# EAGLE design usbprog_v3_x1 (EAGLE 4.16)
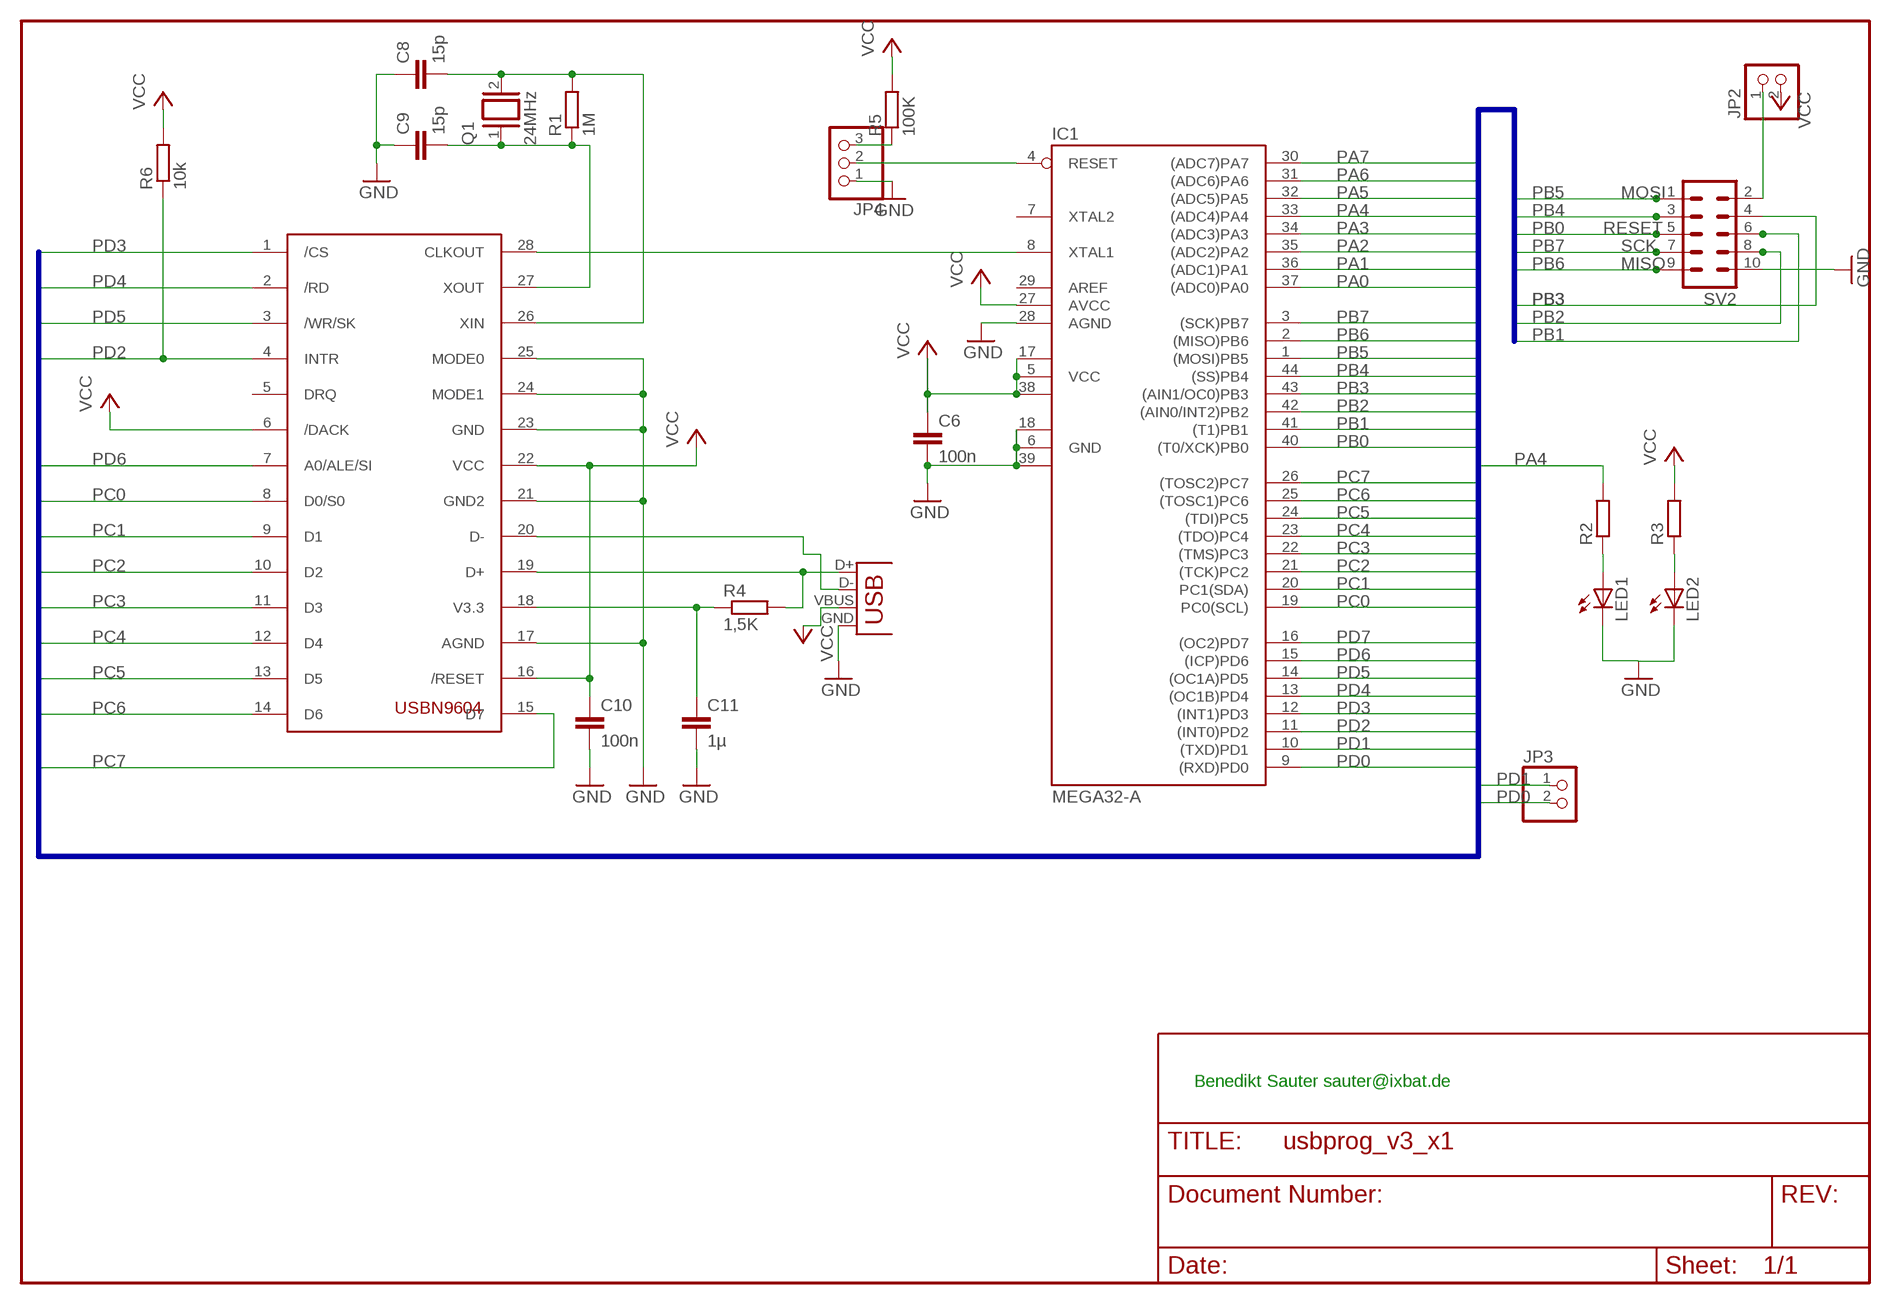
[diagram p0: schematic, sheet 1]

## Parts
C6  100n  C-EUC1206  [C1206]
C8  15p  C-EUC1206  [C1206]
C9  15p  C-EUC1206  [C1206]
C10  100n  C-EUC1206  [C1206]
C11  1µ  C-EUC1206  [C1206]
IC1  MEGA32-A  [TQFP44]
JP2  PINHD-1X2  [1X02]
JP3  PINHD-1X2  [1X02]
JP4  PINHD-1X3  [1X03]
LED1  LEDCHIP-LED0805  [CHIP-LED0805]
LED2  LEDCHIP-LED0805  [CHIP-LED0805]
M1  USBN9604  [SO28-3]
Q1  24MHz  XTAL/S  [QS]
R1  1M  R-EU_R1206  [R1206]
R2  R-EU_M1206  [M1206]
R3  R-EU_M1206  [M1206]
R4  1,5K  R-EU_M1206  [M1206]
R5  100K  R-EU_R1206  [R1206]
R6  10k  R-EU_R1206  [R1206]
SV2  ML10L  [ML10L]
X2  USB-B-H  [USB-B-H]

## Nets
GND: C6.2 C8.1 C9.1 C10.2 C11.2 IC1.6(GND) IC1.18(GND1) IC1.28(AGND) IC1.39(GND2) JP4.1 LED1.C LED2.C M1.17(AGND) M1.21(GND2) M1.23(GND) M1.24(MODE1) M1.25(MODE0) SV2.10 X2.GND
N$3: JP3.1
N$4: IC1.8(XTAL1) M1.28(CLKOUT)
N$5: JP4.3 R5.1
N$7: C11.1 M1.18(V3.3) R4.1
N$8: C8.2 M1.26(XIN) Q1.2 R1.2
N$9: LED1.A R2.1
N$10: LED2.A R3.1
N$11: C9.2 M1.27(XOUT) Q1.1 R1.1
N$12: M1.19(D+) R4.2 X2.D+
N$13: JP3.2
N$14: JP2.1 SV2.2
N$15: M1.20(D-) X2.D-
PA0: IC1.37((ADC0)PA0)
PA1: IC1.36((ADC1)PA1)
PA2: IC1.35((ADC2)PA2)
PA3: IC1.34((ADC3)PA3)
PA4: IC1.33((ADC4)PA4) R2.2
PA5: IC1.32((ADC5)PA5)
PA6: IC1.31((ADC6)PA6)
PA7: IC1.30((ADC7)PA7)
PB0: IC1.40((T0/XCK)PB0) SV2.5
PB1: IC1.41((T1)PB1) SV2.6
PB2: IC1.42((AIN0/INT2)PB2) SV2.8
PB3: IC1.43((AIN1/OC0)PB3) SV2.4
PB4: IC1.44((SS)PB4) SV2.3
PB5: IC1.1((MOSI)PB5) SV2.1
PB6: IC1.2((MISO)PB6) SV2.9
PB7: IC1.3((SCK)PB7) SV2.7
PC0: IC1.19(PC0(SCL)) M1.8(D0/S0)
PC1: IC1.20(PC1(SDA)) M1.9(D1)
PC2: IC1.21((TCK)PC2) M1.10(D2)
PC3: IC1.22((TMS)PC3) M1.11(D3)
PC4: IC1.23((TDO)PC4) M1.12(D4)
PC5: IC1.24((TDI)PC5) M1.13(D5)
PC6: IC1.25((TOSC1)PC6) M1.14(D6)
PC7: IC1.26((TOSC2)PC7) M1.15(D7)
PD0: IC1.9((RXD)PD0)
PD1: IC1.10((TXD)PD1)
PD2: IC1.11((INT0)PD2) M1.4(INTR) R6.1
PD3: IC1.12((INT1)PD3) M1.1(/CS)
PD4: IC1.13((OC1B)PD4) M1.2(/RD)
PD5: IC1.14((OC1A)PD5) M1.3(/WR/SK)
PD6: IC1.15((ICP)PD6) M1.7(A0/ALE/SI)
PD7: IC1.16((OC2)PD7)
RESET: IC1.4(RESET) JP4.2
VCC: C6.1 C10.1 IC1.5(VCC) IC1.17(VCC1) IC1.27(AVCC) IC1.38(VCC2) JP2.2 M1.6(/DACK) M1.16(/RESET) M1.22(VCC) R3.2 R5.2 R6.2 X2.VBUS
Unconnected: IC1.7(XTAL2) M1.5(DRQ)

## Buses
PD0,PD1,PD2,PD3,PD4,PD5,PD6,PD7,PC0,PC1,PC2,PC3,PC4,PC5,PC6,PC7,PB0,PB1,PB2,PB3,PB4,PB5,PB6,PB7,PA0,PA1,PA2,PA3,PA4,PA5,PA6,PA7

## Notes on the sheet
- MOSI
- PB4
- RESET
- SCK
- MISO
- PB3 | PB3
- PB2
- PB1
- Benedikt Sauter sauter@ixbat.de

## Power pins joined to a net without a drawn wire
AREF: IC1.29(AREF)

## Library data of the parts
C6 C8-C11 = rcl:C-EU: CAPACITOR, European symbol
IC1 = avr:MEGA32: MICROCONTROLLER 32 Kbytes FLASH 2 Kbytes SRAM 1 Kbytes EEPROM USART 8-channel 10 bit ADC
JP2 JP3 = pinhead:PINHD-1X2: PIN HEADER
JP4 = pinhead:PINHD-1X3: PIN HEADER
LED1 LED2 = led:LED: LED OSRAM: - CHIPLED LG R971, LG N971, LY N971, LG Q971, LY Q971, LO R971, LY R971 LH N974, LH R974 LS Q976, LO Q976, LY Q976 LO Q996 - Hyper CHIPLED LW Q18S LB Q993, LB Q99A, LB R99A - SideLED LS A670, LO A670, LY A670, LG A670, LP A670 LB A673, LV A673, LT A673, LW A673 LH A674 LY A675 LS A676, LA A676, LO A676, LY A676, LW A676 LS A679, LY A679, LG A679 - Hyper Micro SIDELED® LS Y876, LA Y876, LO Y876, LY Y876 LT Y87S - SmartLED LW L88C, LW L88S LB L89C, LB L89S, LG L890 LS L89K, LO L89K, LY L89K LS L896, LA L896, LO L896, LY L896 - TOPLED LS T670, LO T670, LY T670, LG T670, LP T670 LSG T670, LSP T670, LSY T670, LOP T670, LYG T670 LG T671, LOG T671, LSG T671 LB T673, LV T673, LT T673, LW T673 LH T674 LS T676, LA T676, LO T676, LY T676, LB T676, LH T676, LSB T676, LW T676 LB T67C, LV T67C, LT T67C, LS T67K, LO T67K, LY T67K, LW E67C LS E67B, LA E67B, LO E67B, LY E67B, LB E67C, LV E67C, LT E67C LW T67C LS T679, LY T679, LG T679 LS T770, LO T770, LY T770, LG T770, LP T770 LB T773, LV T773, LT T773, LW T773 LH T774 LS E675, LA E675, LY E675, LS T675 LS T776, LA T776, LO T776, LY T776, LB T776 LHGB T686 LT T68C, LB T68C - Hyper Mini TOPLED® LB M676 - Mini TOPLED Santana® LG M470 LS M47K, LO M47K, LY M47K Source: http://www.osram.convergy.de/
M1 = bene:USBN9604
Q1 = special:XTAL/S: CRYSTAL
R1-R6 = rcl:R-EU_: RESISTOR, European symbol
SV2 = con-harting-ml:ML10: HARTING
X2 = con-usb:USB: USB Connectors

## Board
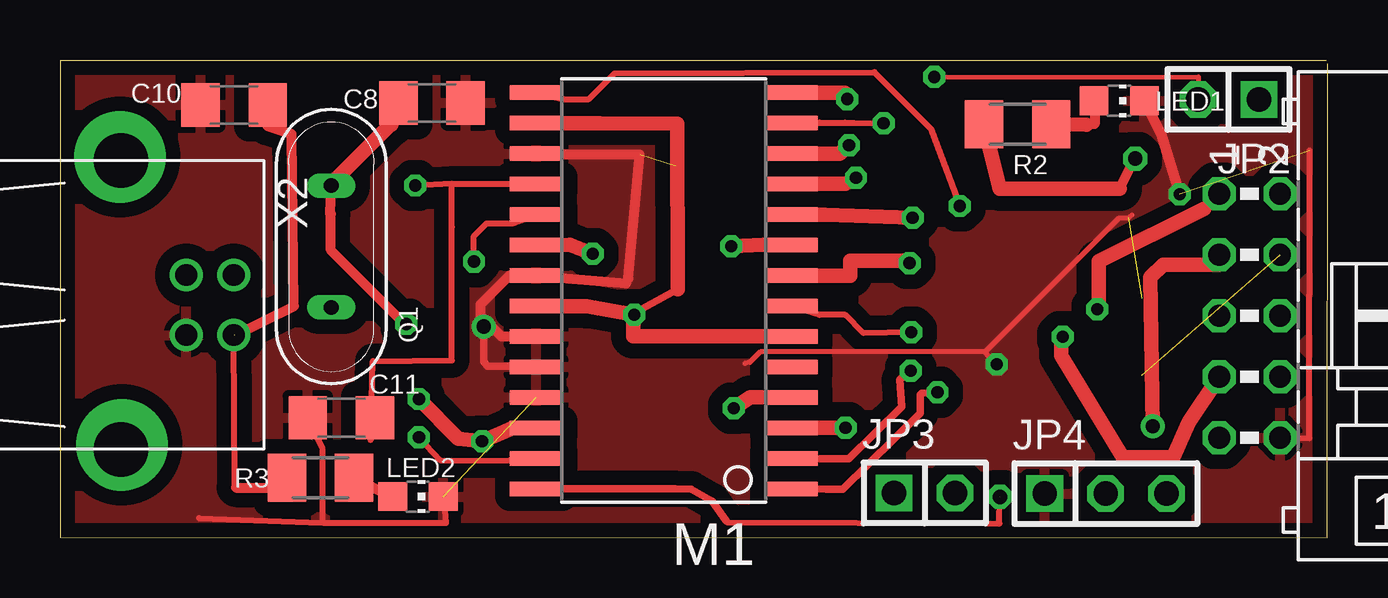
[diagram p1: board, top side]
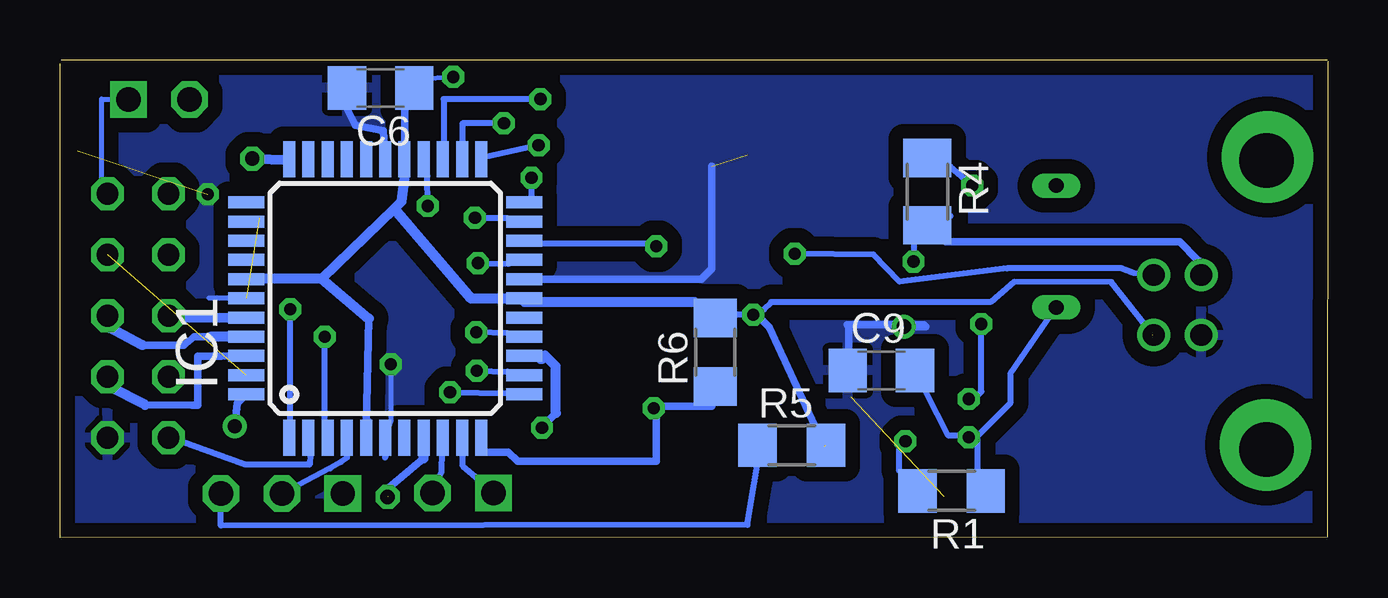
[diagram p2: board, bottom side, seen from below]

Size 52.81 x 19.9 mm. Coordinates in mm from the lower left corner, seen from the top.
Outline: 52.81,19.74 52.81,0 0.01,0.01 0,19.84
Outline: 0.01,19.9 52.76,19.9
Copper layers (1*16): Top 0.035mm / dielectric 1.5mm / Bottom 0.035mm
Design rules "ZWILLING": minimum track width 8mil, minimum drill 20mil, track to track 8mil, track to pad 8mil, pad to pad 8mil, via to via 8mil, smd to smd 0mil, copper to edge 10mil, drill to drill 10mil, minimum pad ring 8mil, minimum via ring 8mil, stop-mask expansion 4mil, vias tented up to drill 0mil, thermal gap 10mil

### Footprints (pad centres in the part's own frame; a part is rotated, then mirrored left to right if it is on the bottom)
C1206 = smd 1.6 x 1.8: 1 -1.4,0; 2 1.4,0
TQFP44 = smd 1.5 x 0.5: 1 -5.8,4; 2 -5.8,3.2; 3 -5.8,2.4; 4 -5.8,1.6; 5 -5.8,0.8; 6 -5.8,0; 7 -5.8,-0.8; 8 -5.8,-1.6; 9 -5.8,-2.4; 10 -5.8,-3.2; 11 -5.8,-4; 23 5.8,-4; 24 5.8,-3.2; 25 5.8,-2.4; 26 5.8,-1.6; 27 5.8,-0.8; 28 5.8,0; 29 5.8,0.8; 30 5.8,1.6; 31 5.8,2.4; 32 5.8,3.2; 33 5.8,4 | smd 0.5 x 1.5: 12 -4,-5.8; 13 -3.2,-5.8; 14 -2.4,-5.8; 15 -1.6,-5.8; 16 -0.8,-5.8; 17 0,-5.8; 18 0.8,-5.8; 19 1.6,-5.8; 20 2.4,-5.8; 21 3.2,-5.8; 22 4,-5.8; 34 4,5.8; 35 3.2,5.8; 36 2.4,5.8; 37 1.6,5.8; 38 0.8,5.8; 39 0,5.8; 40 -0.8,5.8; 41 -1.6,5.8; 42 -2.4,5.8; 43 -3.2,5.8; 44 -4,5.8
1X02 = drill 1.016 square: 1 -1.27,0 | drill 1.016 octagon: 2 1.27,0
1X03 = drill 1.016 square: 1 -2.54,0 | drill 1.016 octagon: 2 0,0; 3 2.54,0
CHIP-LED0805 = smd 1.2 x 1.2: A 0,-1.05; C 0,1.05
SO28-3 = smd 0.61 x 2.21: 1 -8.255,-5.315; 2 -6.985,-5.315; 3 -5.715,-5.315; 4 -4.445,-5.315; 5 -3.175,-5.315; 6 -1.905,-5.315; 7 -0.635,-5.315; 8 0.635,-5.315; 9 1.905,-5.315; 10 3.175,-5.315; 11 4.445,-5.315; 12 5.715,-5.315; 13 6.985,-5.315; 14 8.255,-5.315; 15 8.255,5.315; 16 6.985,5.315; 17 5.715,5.315; 18 4.445,5.315; 19 3.175,5.315; 20 1.905,5.315; 21 0.635,5.315; 22 -0.635,5.315; 23 -1.905,5.315; 24 -3.175,5.315; 25 -4.445,5.315; 26 -5.715,5.315; 27 -6.985,5.315; 28 -8.255,5.315
QS = drill 0.61 long: 1 -2.54,0; 2 2.54,0
R1206 = smd 1.6 x 1.803: 1 -1.422,0; 2 1.422,0
M1206 = smd 1.6 x 2: 1 -1.4,0; 2 1.4,0
ML10L = drill 0.914 octagon: 1 -5.08,-1.27; 2 -5.08,1.27; 3 -2.54,-1.27; 4 -2.54,1.27; 5 0,-1.27; 6 0,1.27; 7 2.54,-1.27; 8 2.54,1.27; 9 5.08,-1.27; 10 5.08,1.27
USB-B-H = drill 0.914 round: D+ 0,1.25; D- 1.981,1.25; GND 0,-1.25; VBUS 1.981,-1.25 | drill 2.286 round: P$1 -2.718,-6.02; P$2 -2.718,6.02

### Placement (x,y rotation side)
C6  39.45,18.73 180 bottom
C8  15.5,18.11 180 top
C9  18.59,6.96 0 bottom
C10  7.26,18.03 180 top
C11  11.72,4.99 180 top
IC1  39.26,9.97 90 bottom
JP2  48.69,18.26 180 top
JP3  36.02,1.86 0 top
JP4  43.57,1.83 0 top
LED1  44.14,18.2 270 top
LED2  14.92,1.71 270 top
M1  25.15,10.28 90 top
Q1  11.3,12.13 90 top
R1  15.66,1.94 180 bottom
R2  39.9,17.22 180 top
R3  10.85,2.5 180 top
R4  16.67,14.41 270 bottom
R5  22.32,3.85 0 bottom
R6  25.51,7.72 90 bottom
SV2  49.56,9.24 270 top
X2  5.26,9.69 0 top

### Tracks (layer width: path | path; a pad name or v marks a point on that pad's centre or on a via)
GND  (via drill 0.51, 0.6)  (4 unrouted)
  Top 0.203: 38.58,7.76 29.2,7.76 28.75,7.3 28.55,7.26 | 38.58,7.76 44.14,13.32 44.52,13.32 44.66,13.44 | v39.03,7.22 38.58,7.68 38.58,7.76 | 46.61,14.4 v46.65,14.31
  Top 0.254: C11.2 10.94,3.68 10.94,0.63 | 5.79,0.81 10.94,0.63 | 10.94,0.63 16.09,0.61 16.02,1.64 LED2.C | SV2.10 52.06,4.15 52.07,16.13
  Top 0.305: M1.24 19.8,7.14 17.83,7.14 17.65,7.32 v17.65,8.79
  Top 0.406: M1.23 19.81,8.38 19.8,8.37 18.4,8.37 17.52,9.25 17.52,9.72 18.72,10.92 M1.21 23.58,10.59 23.69,10.8 24.15,15.95 19.86,15.95 M1.17 | LED1.C 45.87,16.84 46.61,14.4
  Bottom 0.203: 46.6,9.97 45.71,9.97 IC1.39 | 32.44,10.77 32.48,10.8 32.48,10.77 | v39.03,7.22 39.03,4.86 IC1.6
  Bottom 0.254: 32.63,10.8 32.79,10.8 IC1.18 | 39.26,3.34 39.26,3.49 IC1.6 | 32.44,10.77 32.4,10.8
  Bottom 0.305: IC1.18 32.48,10.77 26.09,10.77 25.66,11.2 25.66,15.48 | 40.51,18.43 40.65,18.42 | 40.51,18.43 41.18,18.62 | 40.51,18.43 41.13,18.43 40.51,17.18 39.34,16.95 IC1.28 | 17.68,8.82 v17.65,8.79 16.74,8.79 16.83,8.88 20,8.88 19.94,8.82 19.94,7 19.96,7 C9.1
  pour Bottom (isolate 0.61): 0.13,20.31 52.82,20.32 52.96,0.12 -0.01,0.13
  pour Top (isolate 0.61): 0.28,20.24 53.2,20.21 52.89,0.03 0.36,0.14
N$1  (via drill 1.6 pad 3.81)
  other vias: 2.5,15.86
N$2  (via drill 1.6 pad 3.81)
  other vias: 2.58,3.87
N$4  (1 unrouted)
  Top 0.254: 27.74,0.72 27.78,0.64 38.65,0.59 39.14,0.59 39.15,1.71
  Top 0.305: 27.77,0.69 27.74,0.72 27.17,1.51 26.29,2.02 25.63,2.03 M1.28
  Bottom 0.305: 37.66,3.3 39.11,2.08 39.15,1.7 39.12,1.71
  Bottom 0.406: 37.66,3.3 IC1.8
N$5
  Bottom 0.254: JP4.3 46.11,0.49 24.17,0.53 23.61,3.86 R5.1
N$6  (via drill 0.6)
  other vias: 39.16,1.7
N$7  (via drill 0.51)
  Top 0.254: 16.33,14.74 17.7,14.74 18.77,14.74 M1.18 | 16.33,14.74 16.33,12.94 16.33,7.38 13.03,7.35 12.95,4.07 C11.1 | 16.33,14.74 v14.8,14.67
  Bottom 0.254: v14.8,14.67 15.72,15.45 R4.1
N$8  (via drill 0.51)
  Top 0.254: 18.85,4.56 19.19,4.73 M1.26 | v17.59,4.02 v17.59,4.01
  Top 0.406: v14.42,8.9 14.36,8.9 11.29,11.98 11.29,13.47 11.27,13.49 | 11.27,13.49 11.26,13.5 | 11.27,13.49 Q1.2
  Top 0.61: v17.59,4.02 18.85,4.56 | v17.59,4.01 16.6,4.12 v14.95,5.77 | C8.2 13.81,17.2 13.79,17.22 11.35,14.78 Q1.2
  Bottom 0.254: v17.59,4.02 17.85,3.68 17.85,2.8 R1.2 | v14.95,5.77 14.73,5.77 14.42,6.08 v14.42,8.9
N$9
  Top 0.406: LED1.A 43.11,17.22 42.75,17.2
  Top 0.61: 42.75,17.2 R2.1
N$10
  Top 0.406: LED2.A 13.88,1.66 R3.1
N$11  (via drill 0.51)
  Top 0.254: v14.95,4.17 15.84,3.22 18.74,3.2 M1.27
  Bottom 0.254: 14.95,4.25 14.73,4.25 14.57,4.1 14.57,2.8 R1.1 | 14.95,4.25 15.79,4.25 C9.2 | 14.95,4.25 v14.95,4.17 14.57,4.25 13.2,5.62 13.2,6.84 Q1.1
N$12  (via drill 0.51)
  Top 0.254: v17.25,11.5 17.24,12.56 17.77,13.09 18.84,13.09 M1.19
  Bottom 0.254: v17.25,11.5 17.24,12.25 R4.2 15.72,13.39 | 5.42,11.58 5.29,11.53 X2.D+
  Bottom 0.305: 5.42,11.58 6.17,12.32 15.91,12.32 16.62,13.03 16.64,13.01 R4.2
N$14
  Bottom 0.203: SV2.2 51.07,14.54 51.07,18.27 JP2.1
N$15  (via drill 0.51)
  Top 0.61: v22.2,11.82 21.24,12.21 M1.20
  Bottom 0.254: v22.2,11.82 18.92,11.79 17.84,10.66 13.35,11.22 8.62,11.22 8.07,11.02 X2.D-
N$16
  Bottom 0.254: 37.29,1.91 36.91,2.77 36.87,4.37
N$17
  Bottom 0.254: 34.73,1.9 36.02,2.98 36.02,4.5
PA4  (via drill 0.6)
  Top 0.305: v44.8,15.79 44.8,16.12
  Top 0.406: v44.8,15.79 44.8,15.83 44.17,14.53
  Top 0.61: R2.2 38.5,17.12 39.16,14.53 44.17,14.53
  Bottom 0.406: IC1.33 43.27,15.75 v44.8,15.79
PB0
  Bottom 0.254: 45.74,9.05 IC1.40
  Bottom 0.305: IC1.40 45.25,9.17
  Bottom 0.406: SV2.5 48.31,9.14 45.25,9.17
PB1
  Bottom 0.305: 46.56,8.37 47.21,8.38 47.65,8.01 49.38,8.02
  Bottom 0.406: IC1.41 46.56,8.37 | SV2.6 50.74,8.73 49.38,8.02
PB2
  Bottom 0.305: IC1.42 46.1,7.56 47.07,7.56 47.07,6.48 47.08,5.52 47.29,5.5 49.27,5.52 | 50.71,6.26 SV2.8
  Bottom 0.406: 49.27,5.52 50.71,6.26
PB3  (1 unrouted)
PB4  (via drill 0.6)
  Top 0.305: 48.27,11.38 48.27,11.32 SV2.3
  Top 0.61: v45.53,4.64 45.43,10.84 45.97,11.38 48.27,11.38
  Bottom 0.305: IC1.44 45.43,5.6 v45.53,4.64
PB5  (via drill 0.51)
  Top 0.406: 47.69,13.69 SV2.1 | v43.22,9.51 43.22,9.53 43.19,9.57 43.29,9.66
  Top 0.61: 47.69,13.69 43.29,11.51 43.29,9.66
  Bottom 0.254: v43.22,9.51 43.22,4.86 IC1.1
PB6
  Bottom 0.254: IC1.2 42.39,3.49 42.41,3.04 45.1,3.04 48.32,4.19 SV2.9
PB7  (via drill 0.51)
  Top 0.305: 41.69,8.37 | v41.78,8.37 41.69,8.37 | 41.69,8.37 41.72,8.34
  Top 0.61: SV2.7 47.03,4.8 46.38,3.36 44.28,3.35 41.72,7.59 41.72,8.34
  Bottom 0.254: v41.78,8.37 41.78,4.86 IC1.3
PC0  (via drill 0.51)
  Top 0.61: M1.8 32.94,10.92 32.94,11.53 35.47,11.53 35.47,11.44 v35.4,11.44
  Bottom 0.254: v35.4,11.44 34.16,11.41 IC1.19
PC1  (via drill 0.51)
  Top 0.61: v27.97,12.14 29.32,12.21 M1.9
  Bottom 0.254: v27.97,12.14 28.14,12.25 32.79,12.25 IC1.20
PC2  (via drill 0.51)
  Top 0.61: v35.52,13.33 31.85,13.46 M1.10
  Bottom 0.254: v35.52,13.33 34.16,13.32 IC1.21
PC3  (via drill 0.51)
  Top 0.254: 31.64,14.75 M1.11
  Top 0.61: v33.17,14.99 32.71,14.75 31.64,14.75
  Bottom 0.254: v33.17,14.99 33.17,14.16 IC1.22
PC4  (via drill 0.51)
  Top 0.254: 31.41,15.99 31.34,15.91 M1.12
  Top 0.305: 32.85,16.35 v32.87,16.35
  Top 0.61: 31.41,15.99 32.48,15.99 32.85,16.35
  Bottom 0.254: v32.87,16.35 35.31,15.8 IC1.23
PC5  (via drill 0.51)
  Top 0.254: v34.32,17.26 33.09,17.28 32.71,17.29 31.64,17.29 M1.13
  Bottom 0.254: v34.32,17.26 36.04,17.26 IC1.24
PC6  (via drill 0.51)
  Top 0.61: v32.8,18.27 32.7,18.54 M1.14
  Bottom 0.254: v32.8,18.27 36.83,18.27 36.82,16.44 IC1.25
PC7  (via drill 0.51)
  Top 0.254: v37.49,13.82 36.29,17.03 33.93,19.39 23.11,19.34 22.04,18.27 20.97,18.27 M1.15
  Bottom 0.254: v37.49,13.82 37.51,15.07 IC1.26
PD2  (via drill 0.51)
  Top 0.305: 29.24,5.84 M1.4
  Top 0.61: v28.07,5.39 28.76,5.84 29.24,5.84
  Bottom 0.254: 35.07,3.56 IC1.11
  Bottom 0.305: v28.07,5.39 27.96,5.3 27.96,4.3 27.96,3.17 33.74,3.17 34.13,3.56 35.07,3.56 | 25.24,6.15 25.39,6.3 R6.1 25.65,6.3 25.65,5.46 27.87,5.46
  Bottom 0.406: 27.96,5.4 27.87,5.46 v28.07,5.39 | R6.1 25.46,6.3
PD3  (via drill 0.51)
  Top 0.305: M1.1 31.93,2.02 32.61,2.02 35.84,5.19 35.84,5.95 35.91,6.01 | 35.91,6.01 35.91,6.02 | 35.91,6.01 v36.56,6.06
  Bottom 0.254: v36.56,6.06 34.16,6 IC1.12
PD4  (via drill 0.51)
  Top 0.254: M1.2 31.65,3.29
  Top 0.305: 31.65,3.29 32.87,3.29 35.07,5.46 34.98,6.57 35.36,6.95 v35.45,6.95
  Bottom 0.254: v35.45,6.95 34.16,6.92 IC1.13
PD5  (via drill 0.51)
  Top 0.254: 32.66,4.58 v32.73,4.58
  Top 0.61: M1.3 32.66,4.58
  Bottom 0.254: 32.79,7.45 IC1.14
  Bottom 0.305: v32.73,4.58 32.4,4.93 32.14,5.2
  Bottom 0.406: 32.14,5.2 32.16,5.2 32.16,7.14 32.6,7.58 32.72,7.45 32.79,7.45
PD6  (via drill 0.51)
  Top 0.254: v35.47,8.55 33.47,8.52 32.71,9.28 31.64,9.28 M1.7
  Bottom 0.254: v35.47,8.55 34.16,8.52 IC1.15
RESET
  Bottom 0.254: JP4.2 41.57,2.88 41.1,3.15 40.85,3.33 40.87,4.22 IC1.4
VCC  (via drill 0.51)  (2 unrouted)
  Top 0.203: v36.43,19.19 47.43,19.18 JP2.2
  Top 0.254: 7.33,2.08 7.29,2.09 X2.VBUS
  Top 0.305: 23.8,9.28 23.77,9.25 | v23.92,9.28 23.8,9.28 | 23.8,9.28 25.74,10.34
  Top 0.406: 7.28,8.44 9.74,9.64 9.65,16.81 8.65,17.15 C10.1 | v23.92,9.28 23.88,9.28 | 9.44,2.29 9.44,2.3 | 9.44,2.29 R3.2 | 7.33,2.08 9.44,2.08 9.44,2.29
  Top 0.61: v23.92,9.28 21.94,9.64 M1.22 | M1.16 22.5,17.27 25.72,17.25 25.74,10.34 | M1.6 23.88,8.38 23.88,9.28
  Bottom 0.203: v36.43,19.19 37.81,19.11 C6.1
  Bottom 0.254: 44.57,10.78 IC1.38 | 38.43,15.13 IC1.27 | IC1.5 39.98,4.69 39.95,4.86 | 32.79,9.81 IC1.17 33.48,9.95 | 26.38,9.81 R6.2 24.63,9.28 v23.92,9.28 23.49,9.51 23.18,9.81 14.04,9.81 13.05,10.65 9.01,10.65 7.29,8.45 X2.VBUS
  Bottom 0.305: 39.98,4.69 40.05,4.69 40.06,4.7 40.05,4.63 39.95,9.13 | v23.92,9.28 23.83,9.28 23.8,9.31 23.26,8.76 20.97,3.81 | IC1.27 38.45,15.77 38.45,18.49 C6.1
  Bottom 0.406: 41.9,10.78 44.57,10.78 | 38.88,13.7 38.58,14 38.43,15.13 | 38.88,13.7 41.9,10.78 | 41.9,10.78 39.95,9.13 | 33.48,9.95 35.69,9.95 38.88,13.7 | 33.45,9.97 33.45,9.99 | 33.45,9.97 IC1.17 | 26.38,9.81 33.45,9.81 33.45,9.97

### Text on the board
tDocu: B. Sauter | usbprog 3.0